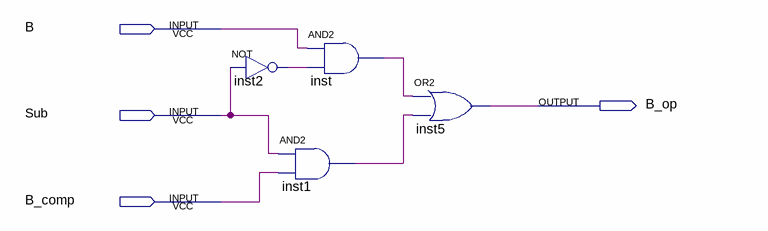
[diagram p0: schematic sheet]
// Quartus schematic mux2_1.bdf as structural Verilog: 4 symbols, 4 pins
module mux2_1 (
  input  B,
  input  Sub,
  input  B_comp,
  output B_op
);

  wire inst1_out, inst2_out, inst_out;

  not inst2 (inst2_out, Sub);
  and inst (inst_out, B, inst2_out);
  and inst1 (inst1_out, Sub, B_comp);
  or inst5 (B_op, inst_out, inst1_out);
endmodule
